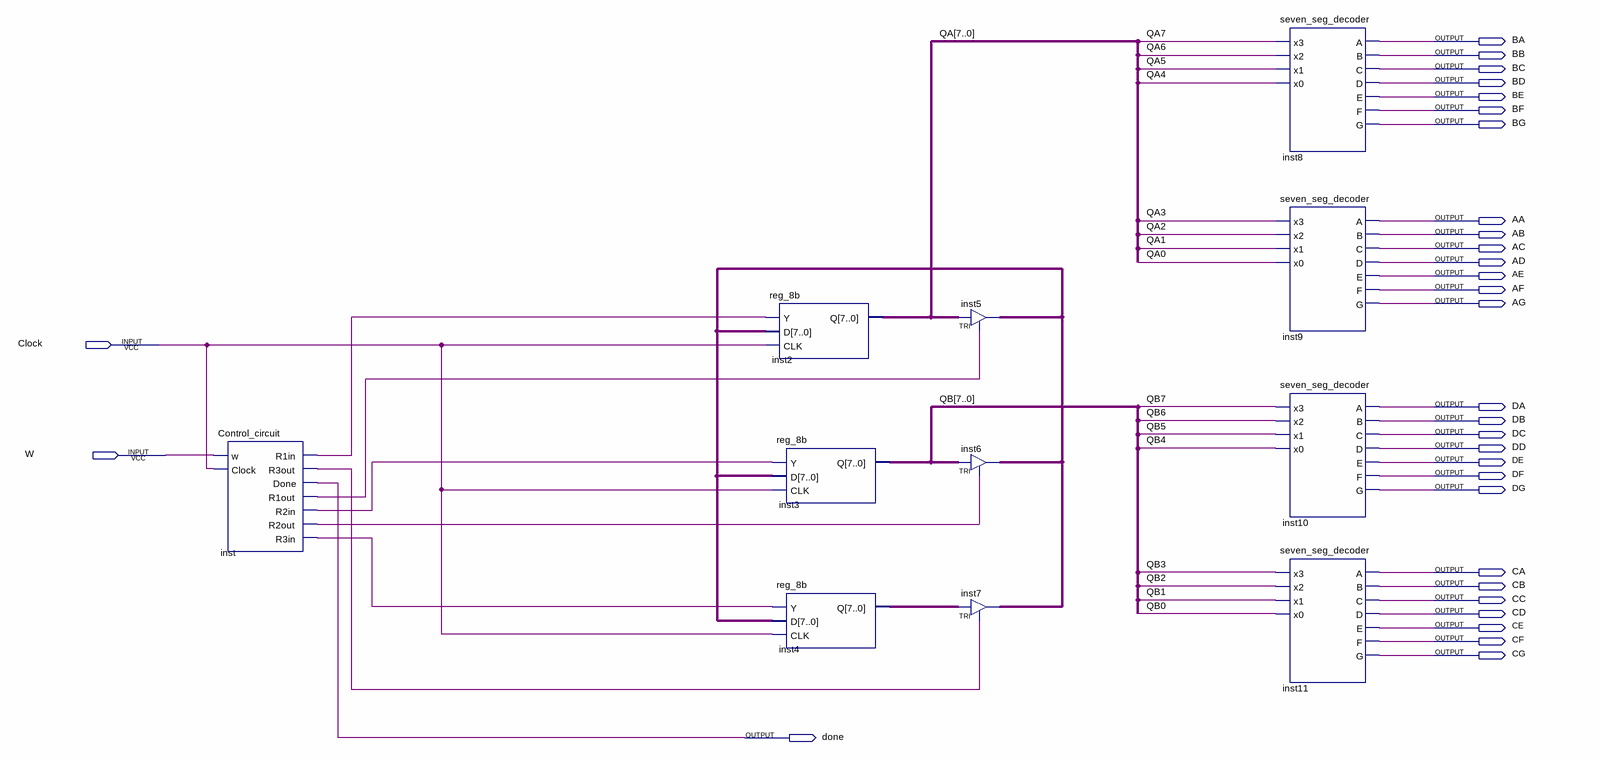
[diagram p0: schematic sheet]
// Quartus schematic Swap.bdf as structural Verilog: 11 symbols, 31 pins
module Swap (
  input  Clock,
  input  W,
  output BA,
  output BB,
  output BC,
  output BD,
  output BE,
  output BF,
  output BG,
  output AA,
  output AB,
  output AC,
  output AD,
  output AE,
  output AF,
  output AG,
  output DA,
  output DB,
  output DC,
  output DD,
  output DE,
  output DF,
  output DG,
  output CA,
  output CB,
  output CC,
  output CD,
  output CE,
  output CF,
  output CG,
  output done
);

  wire inst_r1in, inst_r1out, inst_r2in, inst_r2out, inst_r3in, inst_r3out;
  wire [7:0] inst4_q, inst5_out, QA, QB;

  Control_circuit inst (
    .w(W), .Clock(Clock), .R1in(inst_r1in), .R3out(inst_r3out), .Done(done), .R1out(inst_r1out),
    .R2in(inst_r2in), .R2out(inst_r2out), .R3in(inst_r3in));
  reg_8b inst2 (.Y(inst_r1in), .D(inst5_out), .CLK(Clock), .Q(QA));
  reg_8b inst3 (.Y(inst_r2in), .D(inst5_out), .CLK(Clock), .Q(QB));
  reg_8b inst4 (.Y(inst_r3in), .D(inst5_out), .CLK(Clock), .Q(inst4_q));
  TRI inst5[7:0] (.IN(QA), .OE(inst_r1out), .OUT(inst5_out));
  TRI inst6[7:0] (.IN(QB), .OE(inst_r2out), .OUT(inst5_out));
  TRI inst7[7:0] (.IN(inst4_q), .OE(inst_r3out), .OUT(inst5_out));
  seven_seg_decoder inst8 (
    .x3(QA[7]), .x2(QA[6]), .x1(QA[5]), .x0(QA[4]), .A(BA), .B(BB), .C(BC), .D(BD), .E(BE), .F(BF), .G(BG));
  seven_seg_decoder inst9 (
    .x3(QA[3]), .x2(QA[2]), .x1(QA[1]), .x0(QA[0]), .A(AA), .B(AB), .C(AC), .D(AD), .E(AE), .F(AF), .G(AG));
  seven_seg_decoder inst10 (
    .x3(QB[7]), .x2(QB[6]), .x1(QB[5]), .x0(QB[4]), .A(DA), .B(DB), .C(DC), .D(DD), .E(DE), .F(DF), .G(DG));
  seven_seg_decoder inst11 (
    .x3(QB[3]), .x2(QB[2]), .x1(QB[1]), .x0(QB[0]), .A(CA), .B(CB), .C(CC), .D(CD), .E(CE), .F(CF), .G(CG));
endmodule
